# Altium project PCB_BOTTANI.PrjPcb
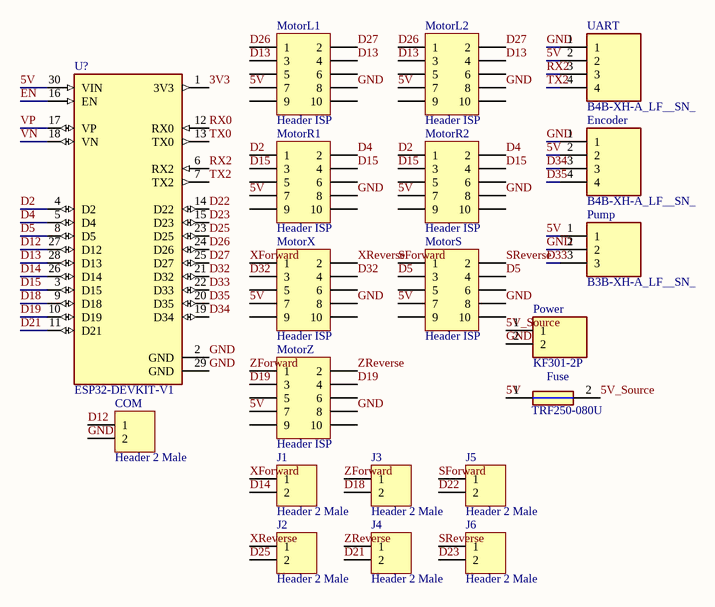
[diagram p0: Skematik Bottani.SchDoc]
1 sheet, 20 parts. Net scope: global (net labels, ports and power ports of the same name join across sheets).
Board file: PCB Bottani.PcbDoc

## Sheet Skematik Bottani.SchDoc
size A4

### Parts
COM  Header 2 Male  [Header 2 Male]
Encoder  B4B-XH-A_LF__SN_  [SHDR4W64P0X250_1X4_1240X575X700P]
Fuse  TRF250-080U  [TRF250080U]
J1  Header 2 Male  [Header 2 Male]
J2  Header 2 Male  [Header 2 Male]
J3  Header 2 Male  [Header 2 Male]
J4  Header 2 Male  [Header 2 Male]
J5  Header 2 Male  [Header 2 Male]
J6  Header 2 Male  [Header 2 Male]
MotorL1  Header ISP  [Header ISP]
MotorL2  Header ISP  [Header ISP]
MotorR1  Header ISP  [Header ISP]
MotorR2  Header ISP  [Header ISP]
MotorS  Header ISP  [Header ISP]
MotorX  Header ISP  [Header ISP]
MotorZ  Header ISP  [Header ISP]
Power  KF301-2P  [KF3012P]
Pump  B3B-XH-A_LF__SN_  [B3BXHALFSN]
U?  ESP32-DEVKIT-V1  [esp32_30p]
UART  B4B-XH-A_LF__SN_  [SHDR4W64P0X250_1X4_1240X575X700P]

### Nets
3V3: U?.1(3V3)
5V: Encoder.2 Fuse.1 MotorL1.7 MotorL2.7 MotorR1.7 MotorR2.7 MotorS.7 MotorX.7 MotorZ.7 Pump.1 U?.30(VIN) UART.2
5V_Source: Fuse.2 Power.1
D2: MotorR1.1 MotorR2.1 U?.4(D2)
D4: MotorR1.2 MotorR2.2 U?.5(D4)
D5: MotorS.3 MotorS.4 U?.8(D5)
D12: COM.1 U?.27(D12)
D13: MotorL1.3 MotorL1.4 MotorL2.3 MotorL2.4 U?.28(D13)
D14: J1.2 U?.26(D14)
D15: MotorR1.3 MotorR1.4 MotorR2.3 MotorR2.4 U?.3(D15)
D18: J3.2 U?.9(D18)
D19: MotorZ.3 MotorZ.4 U?.10(D19)
D21: J4.2 U?.11(D21)
D22: J5.2 U?.14(D22)
D23: J6.2 U?.15(D23)
D25: J2.2 U?.23(D25)
D26: MotorL1.1 MotorL2.1 U?.24(D26)
D27: MotorL1.2 MotorL2.2 U?.25(D27)
D32: MotorX.3 MotorX.4 U?.21(D32)
D33: Pump.3 U?.22(D33)
D34: Encoder.3 U?.19(D34)
D35: Encoder.4 U?.20(D35)
EN: U?.16(EN)
GND: COM.2 Encoder.1 MotorL1.8 MotorL2.8 MotorR1.8 MotorR2.8 MotorS.8 MotorX.8 MotorZ.8 Power.2 Pump.2 U?.2(GND) U?.29(GND) UART.1
RX0: U?.12(RX0)
RX2: U?.6(RX2) UART.3
SForward: J5.1 MotorS.1
SReverse: J6.1 MotorS.2
TX0: U?.13(TX0)
TX2: U?.7(TX2) UART.4
VN: U?.18(VN)
VP: U?.17(VP)
XForward: J1.1 MotorX.1
XReverse: J2.1 MotorX.2
ZForward: J3.1 MotorZ.1
ZReverse: J4.1 MotorZ.2

Not connected (* = marked no-connect by the designer): MotorL1 5 6 9 10; MotorL2 5 6 9 10; MotorR1 5 6 9 10; MotorR2 5 6 9 10; MotorS 5 6 9 10; MotorX 5 6 9 10; MotorZ 5 6 9 10

### Library data of the parts
Encoder UART = B4B-XH-A_LF__SN_: Connector; Manufacturer_Name: JST (JAPAN SOLDERLESS TERMINALS); Manufacturer_Part_Number: B4B-XH-A(LF)(SN); Datasheet Link: http://uk.rs-online.com/web/p/products/8201551; Height: 7mm
Fuse = TRF250-080U: Fuse; Manufacturer_Name: LITTELFUSE; Datasheet Link: https://www.littelfuse.com/~/media/electronics/product_specifications/resettable_ptcs/littelfuse_ptc_trf250_080u_product_specification.pdf.pdf; Height: 9.3mm; Manufacturer_Part_Number: TRF250-080U; Mouser Part Number: 650-TRF250-080U; Mouser Price/Stock: https://www.mouser.co.uk/ProductDetail/Littelfuse/TRF250-080U?qs=iWbXB9lueyAgWrbRiwwadg%3D%3D; Arrow Part Number: TRF250-080U; Arrow Price/Stock: https://www.arrow.com/en/products/trf250-080u/littelfuse
Power = KF301-2P: Connector; Manufacturer_Name: Handson Technology; Datasheet Link: http://www.handsontec.com/dataspecs/terminal%20block-5mm.pdf; Height: 10mm; Manufacturer_Part_Number: KF301-2P
Pump = B3B-XH-A_LF__SN_: Connector; Manufacturer_Name: JST (JAPAN SOLDERLESS TERMINALS); Manufacturer_Part_Number: B3B-XH-A(LF)(SN); Datasheet Link: https://datasheet.lcsc.com/szlcsc/1812131720_JST-Sales-America-B3B-XH-A-LF-SN_C144394.pdf; Height: 7mm; Arrow Part Number: B3B-XH-A(LF)(SN); Arrow Price/Stock: https://www.arrow.com/en/products/b3b-xh-a-lf-sn/jst-manufacturing?region=europe
U? = ESP32-DEVKIT-V1: Dual core, Wi-Fi: 2.4 GHz up to 150 Mbits/s,BLE (Bluetooth Low Energy) and legacy Bluetooth, 32 bits, Up to 240 MHz; MF: Do it; Price: None; Availability: Not in stock; Package: None; MP: ESP32-DEVKIT-V1; Value: *; SnapEDA_Link: https://www.snapeda.com/parts/ESP32-DEVKIT-V1/Do+it/view-part/?ref=snap; Check_prices: https://www.snapeda.com/parts/ESP32-DEVKIT-V1/Do+it/view-part/?ref=eda